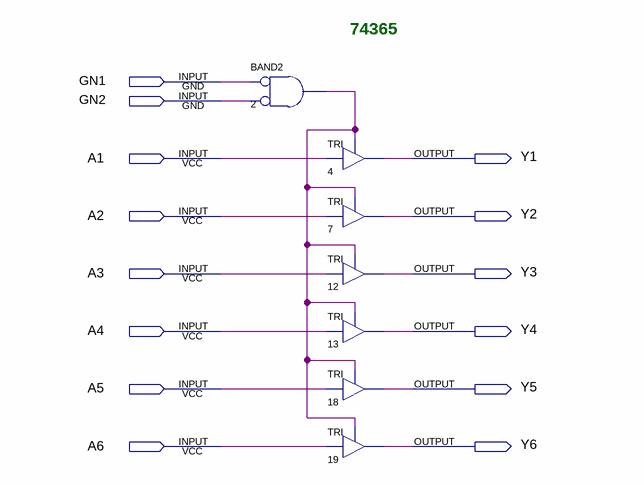
[diagram p0: schematic sheet]
// Quartus schematic 74365.bdf as structural Verilog: 7 symbols, 14 pins
module \74365  (
  input  GN1,
  input  GN2,
  input  A1,
  input  A2,
  input  A3,
  input  A4,
  input  A5,
  input  A6,
  output Y1,
  output Y2,
  output Y3,
  output Y4,
  output Y5,
  output Y6
);

  wire n2_out;

  and u_2 (n2_out, ~GN1, ~GN2);  // BAND2
  TRI u_4 (.IN(A1), .OE(n2_out), .OUT(Y1));
  TRI u_7 (.IN(A2), .OE(n2_out), .OUT(Y2));
  TRI u_12 (.IN(A3), .OE(n2_out), .OUT(Y3));
  TRI u_13 (.IN(A4), .OE(n2_out), .OUT(Y4));
  TRI u_18 (.IN(A5), .OE(n2_out), .OUT(Y5));
  TRI u_19 (.IN(A6), .OE(n2_out), .OUT(Y6));

  // Notes on the sheet:
  //   74365
endmodule
